# Altium schematic sheet US_EPS_SP.SchDoc
size A4
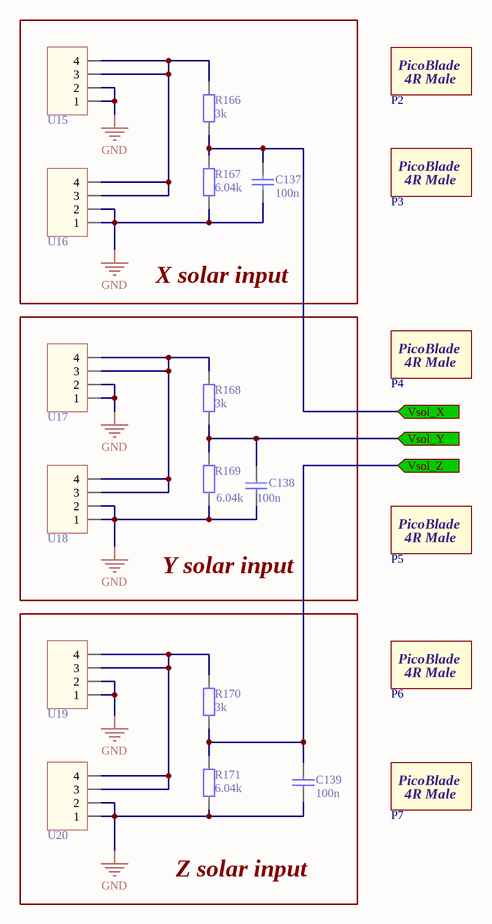
[diagram p0: US_EPS_SP.SchDoc]

## Parts
C137  100n  [C0603_IPC_HD]
C138  100n  [C0603_IPC_HD]
C139  100n  [C0603_IPC_HD]
P2  PicoBlade_4R_MALE  (value not drawn)  (mechanical)
P3  PicoBlade_4R_MALE  (value not drawn)  (mechanical)
P4  PicoBlade_4R_MALE  (value not drawn)  (mechanical)
P5  PicoBlade_4R_MALE  (value not drawn)  (mechanical)
P6  PicoBlade_4R_MALE  (value not drawn)  (mechanical)
P7  PicoBlade_4R_MALE  (value not drawn)  (mechanical)
R166  3k  [C0603_IPC_HD]
R167  6.04k  [C0603_IPC_HD]
R168  3k  [C0603_IPC_HD]
R169  6.04k  [C0603_IPC_HD]
R170  3k  [C0603_IPC_HD]
R171  6.04k  [C0603_IPC_HD]
U15  PicoBlade_4R  [PB_53261-0471_Right]  (value not drawn)
U16  PicoBlade_4R  [PB_53261-0471_Right]  (value not drawn)
U17  PicoBlade_4R  [PB_53261-0471_Right]  (value not drawn)
U18  PicoBlade_4R  [PB_53261-0471_Right]  (value not drawn)
U19  PicoBlade_4R  [PB_53261-0471_Right]  (value not drawn)
U20  PicoBlade_4R  [PB_53261-0471_Right]  (value not drawn)

## Blocks framed on the sheet
X solar input: C137 R166 R167 U15 U16
Y solar input: C138 R168 R169 U17 U18
Z solar input: C139 R170 R171 U19 U20

## Ports
Vsol_X (in), Vsol_Y (in), Vsol_Z (in)

## Nets
GND: C137.1 C138.1 C139.1 R167.1 R169.1 R171.1 U15.1 U15.2 U16.1 U16.2 U17.1 U17.2 U18.1 U18.2 U19.1 U19.2 U20.1 U20.2
Vsol_X: C137.2 R166.1 R167.2 ; port Vsol_X
Vsol_Y: C138.2 R168.1 R169.2 ; port Vsol_Y
Vsol_Z: C139.2 R170.1 R171.2 ; port Vsol_Z
NetR166_2: R166.2 U15.3 U15.4 U16.3 U16.4
NetR168_2: R168.2 U17.3 U17.4 U18.3 U18.4
NetR170_2: R170.2 U19.3 U19.4 U20.3 U20.4

## Notes on the sheet
- (in symbol PicoBlade_4R_M) PicoBlade; 4R Male

## Library data of the parts
C137-C139 = CL10B104KO8NNNC: CAP CER 0.1UF 16V X7R 0603; Manufacturer: Samsung Electro-Mechanics; Manufacturer Part Number: CL10B104KO8NNNC; Voltage: 16V; Value: 100n; Dielectric: X7R; Supplier 1: Digi-Key; Supplier Part Number 1: 1276-1005-1-ND
P2-P7 = PicoBlade_4R_M: MALE Connector Header Surface Mount 4 position 0.049" (1.25mm); Manufacturer: China; Manufacturer Part Number: PicoBlade_4R_MALE; Supplier 1: Aliexpress; Supplier Part Number 1: PicoBlade_4R_M
R166 R168 R170 = CR0603-JW-3k: RES SMD 3K OHM 5% 1/10W 0603; Manufacturer: Bourns Inc.; Manufacturer Part Number: CR0603-JW-302ELF; Value: 3k; Tolarance: ±5%; Supplier 1: Digi-Key; Supplier Part Number 1: CR0603-JW-302ELFCT-ND
R167 R169 R171 = CR0603-JW-6.04K: RES 6.04K OHM 1% 1/10W 0603; Manufacturer: Stackpole Electronics Inc; Manufacturer Part Number: RMCF0603FT6K04; Value: 6.04k; Tolarance: ±1%; Supplier 1: Digi-Key; Supplier Part Number 1: RMCF0603FT6K04CT-ND
U15-U20 = PicoBlade_4R: Connector Header Surface Mount 4 position 0.049" (1.25mm); Manufacturer: China; Manufacturer Part Number: PicoBlade_4R; Supplier 1: Aliexpress; Supplier Part Number 1: PicoBlade_4R